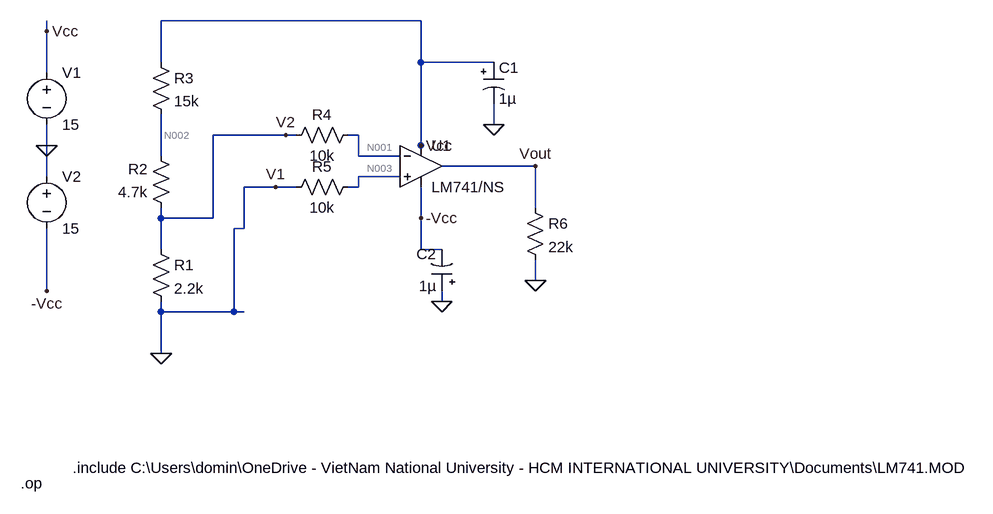
[diagram p0: schematic Draft4.asc]
Draft4.asc, the LTspice schematic file:
Version 4
SHEET 1 880 26008
WIRE -100960 25280 -101360 25280
WIRE -101536 25296 -101536 25280
WIRE -101360 25344 -101360 25280
WIRE -100960 25344 -100960 25280
WIRE -100848 25344 -100960 25344
WIRE -101536 25360 -101536 25296
WIRE -100848 25440 -100848 25408
WIRE -101168 25456 -101280 25456
WIRE -101152 25456 -101168 25456
WIRE -101056 25456 -101072 25456
WIRE -101536 25472 -101536 25440
WIRE -100960 25472 -100960 25344
WIRE -101360 25488 -101360 25424
WIRE -101056 25488 -101056 25456
WIRE -100992 25488 -101056 25488
WIRE -100960 25488 -100960 25472
WIRE -100784 25504 -100928 25504
WIRE -101536 25520 -101536 25472
WIRE -100992 25520 -101056 25520
WIRE -101184 25536 -101232 25536
WIRE -101152 25536 -101184 25536
WIRE -101056 25536 -101056 25520
WIRE -101056 25536 -101072 25536
WIRE -100784 25568 -100784 25504
WIRE -101360 25584 -101360 25568
WIRE -101280 25584 -101280 25456
WIRE -101280 25584 -101360 25584
WIRE -100960 25584 -100960 25536
WIRE -101232 25600 -101232 25536
WIRE -101232 25600 -101248 25600
WIRE -101360 25632 -101360 25584
WIRE -100960 25632 -100960 25584
WIRE -100928 25632 -100960 25632
WIRE -100784 25680 -100784 25648
WIRE -101536 25696 -101536 25600
WIRE -100928 25712 -100928 25696
WIRE -101360 25728 -101360 25712
WIRE -101248 25728 -101248 25600
WIRE -101248 25728 -101360 25728
WIRE -101232 25728 -101248 25728
WIRE -101360 25792 -101360 25728
FLAG -101536 25472 0
FLAG -101536 25296 Vcc
FLAG -101536 25696 -Vcc
FLAG -100960 25472 Vcc
FLAG -100960 25584 -Vcc
FLAG -101360 25792 0
FLAG -100784 25504 Vout
FLAG -101184 25536 V1
FLAG -101168 25456 V2
FLAG -100784 25680 0
FLAG -100848 25440 0
FLAG -100928 25712 0
SYMBOL voltage -101536 25344 R0
WINDOW 123 0 0 Left 0
WINDOW 39 0 0 Left 0
SYMATTR InstName V1
SYMATTR Value 15
SYMBOL OpAmps\\opamp2 -100960 25440 R0
SYMATTR InstName U1
SYMATTR Value LM741/NS
SYMBOL voltage -101536 25504 R0
WINDOW 123 0 0 Left 0
WINDOW 39 0 0 Left 0
SYMATTR InstName V2
SYMATTR Value 15
SYMBOL res -101376 25616 R0
SYMATTR InstName R1
SYMATTR Value 2.2k
SYMBOL res -101344 25584 R180
WINDOW 0 36 76 Left 2
WINDOW 3 36 40 Left 2
SYMATTR InstName R2
SYMATTR Value 4.7k
SYMBOL res -101376 25328 R0
SYMATTR InstName R3
SYMATTR Value 15k
SYMBOL res -101056 25440 R90
WINDOW 0 0 56 VBottom 2
WINDOW 3 32 56 VTop 2
SYMATTR InstName R4
SYMATTR Value 10k
SYMBOL res -101056 25520 R90
WINDOW 0 0 56 VBottom 2
WINDOW 3 32 56 VTop 2
SYMATTR InstName R5
SYMATTR Value 10k
SYMBOL res -100800 25552 R0
SYMATTR InstName R6
SYMATTR Value 22k
SYMBOL polcap -100864 25344 R0
WINDOW 3 24 56 Left 2
SYMATTR InstName C1
SYMATTR Value 1µ
SYMATTR Description Capacitor
SYMATTR Type cap
SYMATTR SpiceLine V=16 Irms=0 Rser=11 Lser=0 mfg="AVX" pn="TAJA105K016" type="Tantalum"
SYMBOL polcap -100912 25696 R180
WINDOW 0 24 57 Left 2
WINDOW 3 24 8 Left 2
SYMATTR InstName C2
SYMATTR Value 1µ
SYMATTR Description Capacitor
SYMATTR Type cap
SYMATTR SpiceLine V=16 Irms=0 Rser=11 Lser=0 mfg="AVX" pn="TAJA105K016" type="Tantalum"
TEXT -101496 25968 Left 2 !.include C:\\Users\\domin\\OneDrive - VietNam National University - HCM INTERNATIONAL UNIVERSITY\\Documents\\LM741.MOD
TEXT -101576 25992 Left 2 !.op

The netlist it stands for:
* Draft4.asc
V1 Vcc 0 15
XU1 N003 N001 Vcc -Vcc Vout LM741/NS  ; pins In+ In- V+ V- OUT
V2 0 -Vcc 15
R1 V2 0 2.2k
R2 V2 N002 4.7k
R3 Vcc N002 15k
R4 N001 V2 10k
R5 N003 0 10k
R6 Vout 0 22k
C1 Vcc 0 1µ V=16 Irms=0 Rser=11 Lser=0 mfg="AVX" pn="TAJA105K016" type="Tantalum"
C2 0 -Vcc 1µ V=16 Irms=0 Rser=11 Lser=0 mfg="AVX" pn="TAJA105K016" type="Tantalum"
.include C:\Users\domin\OneDrive - VietNam National University - HCM INTERNATIONAL UNIVERSITY\Documents\LM741.MOD
.op
.backanno
.end

* Results of the author's LTspice run, read from the files saved beside the schematic
* Operating Point:
*   V(vcc) = 15 V
*   V(n001) = 1.47 V
*   V(n003) = 29.02 mV
*   V(-vcc) = -15 V
*   V(vout) = -13.96 V
*   V(v2) = 1.501 V
*   V(n002) = 4.721 V
*   I(C1) = 0 A
*   I(C2) = 0 A
*   I(R1) = 682.2 µA
*   I(R2) = -685.2 µA
*   I(R3) = 685.2 µA
*   I(R4) = -3.062 µA
*   I(R5) = 2.902 µA
*   I(R6) = -634.5 µA
*   I(V1) = -2.207 mA
*   I(V2) = -2.157 mA
*   Ix(u1:1) = -2.902 µA
*   Ix(u1:2) = 3.062 µA
*   Ix(u1:99) = 1.522 mA
*   Ix(u1:50) = -2.157 mA
*   Ix(u1:28) = 634.5 µA
* From the log:
*   Semiconductor Device Operating Points:
*                           --- Diodes ---
*   Name:    d:u1:1      d:u1:2      d:u1:5      d:u1:6      d:u1:4
*   Model:    u1:dx       u1:dx       u1:dx       u1:dx       u1:dx
*   Id:     -2.74e-11    1.08e-04    6.40e-04    5.63e-06   -1.12e-13
*   Vd:     -2.74e+01    6.57e-01    7.03e-01    5.81e-01   -1.11e-01
*   Req:     1.00e+12    2.39e+02    4.04e+01    4.59e+03    9.99e+11
*   CAP:     0.00e+00    0.00e+00    0.00e+00    0.00e+00    0.00e+00
*   Name:    d:u1:3
*   Model:    u1:dx
*   Id:     -2.50e-13
*   Vd:     -2.49e-01
*   Req:     1.00e+12
*   CAP:     0.00e+00
*                           --- Bipolar Transistors ---
*   Name:     q:u1:1      q:u1:2
*   Model:     u1:qx       u1:qx
*   Ib:       1.60e-07   -1.57e-11
*   Ic:       9.98e-05    1.50e-11
*   Vbe:      7.15e-01   -7.25e-01
*   Vbc:     -1.35e+01   -1.50e+01
*   Vce:      1.42e+01    1.42e+01
*   BetaDC:   6.25e+02   -9.54e-01
*   Gm:       3.86e-03    2.55e-27
*   Rpi:      1.62e+05    1.00e+12
*   Rx:       0.00e+00    0.00e+00
*   Ro:       0.00e+00    0.00e+00
*   Cbe:      0.00e+00    0.00e+00
*   Cbc:      0.00e+00    0.00e+00
*   Cjs:      0.00e+00    0.00e+00
*   BetaAC:   6.25e+02    2.55e-15
*   Cbx:      0.00e+00    0.00e+00
*   Ft:       0.00e+00    0.00e+00